# Altium schematic sheet NAVIGATION-PHERIPHERAL.SchDoc
size A3; SheetNumber: 4; SheetTotal: 7
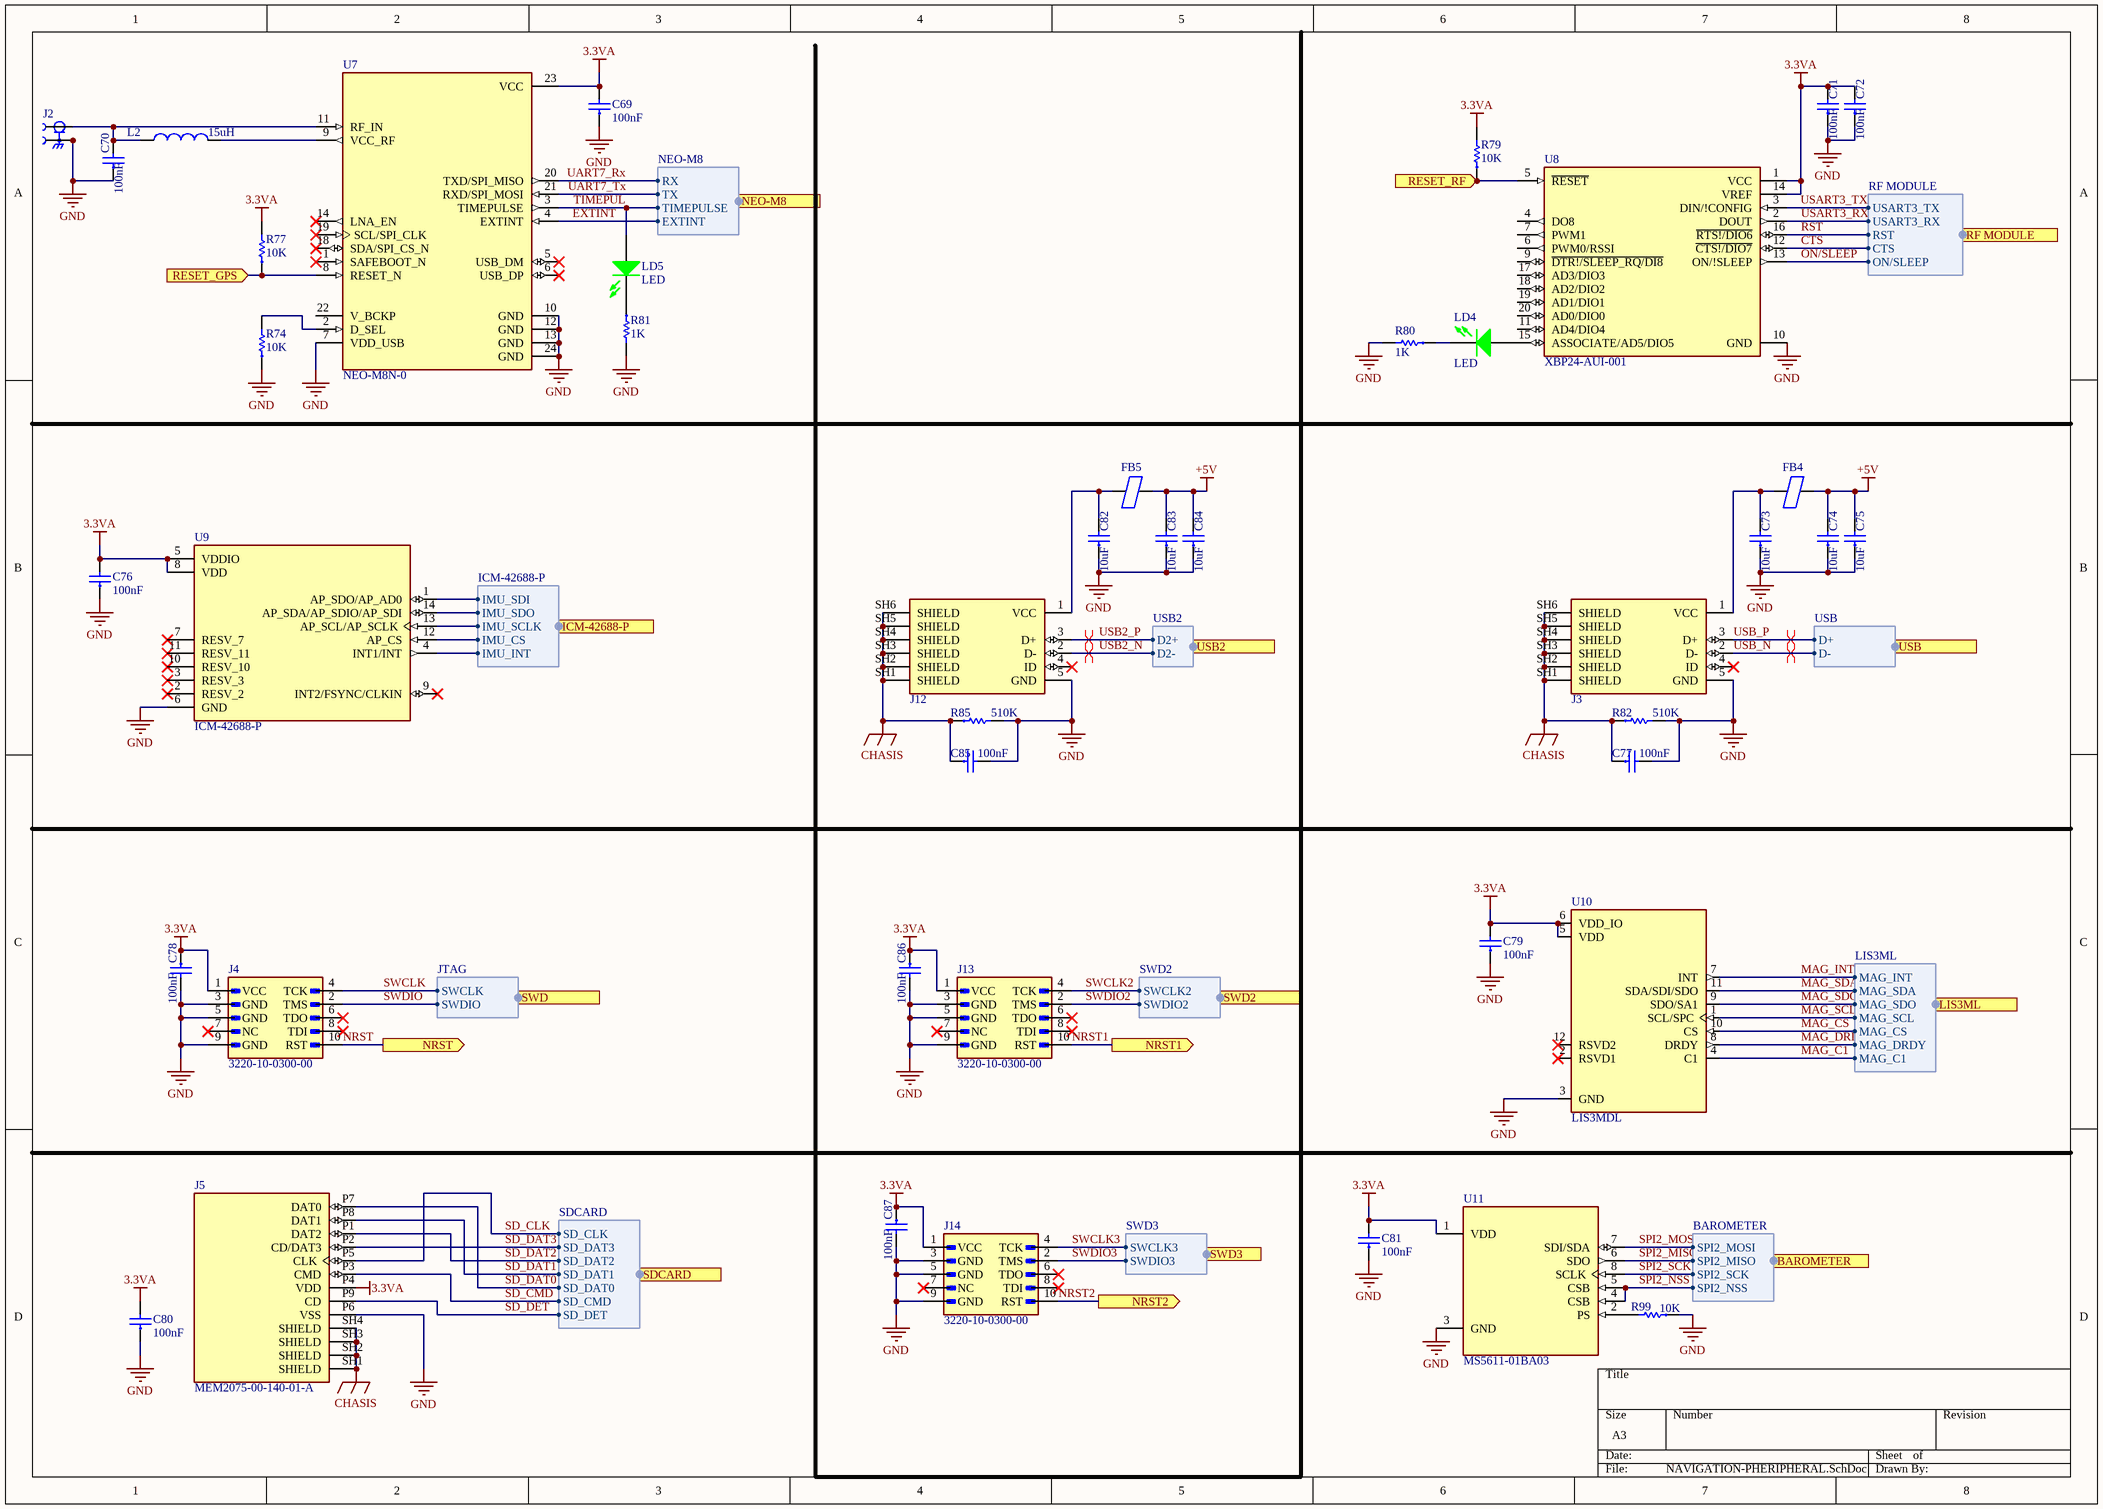
[diagram p0: NAVIGATION-PHERIPHERAL.SchDoc]

## Parts
C69  100nF  [CAP-CER0402-0.5H]
C70  100nF  [CAP-CER0402-0.5H]
C71  100nF  [CAP-CER0402-0.5H]
C72  100nF  [CAP-CER0402-0.5H]
C73  10uF  [CAP-CER0402-20mil]
C74  10uF  [CAP-CER0402-20mil]
C75  10uF  [CAP-CER0402-20mil]
C76  100nF  [CAP-CER0402-0.5H]
C77  100nF  [CAP-CER0603-0.8H]
C78  100nF  [CAP-CER0402-0.5H]
C79  100nF  [CAP-CER0402-0.5H]
C80  100nF  [CAP-CER0402-0.5H]
C81  100nF  [CAP-CER0402-0.5H]
C82  10uF  [CAP-CER0402-20mil]
C83  10uF  [CAP-CER0402-20mil]
C84  10uF  [CAP-CER0402-20mil]
C85  100nF  [CAP-CER0603-0.8H]
C86  100nF  [CAP-CER0402-0.5H]
C87  100nF  [CAP-CER0402-0.5H]
FB4  100MHz 2A 50mOhm  [FB 0603]  (value not drawn)
FB5  100MHz 2A 50mOhm  [FB 0603]  (value not drawn)
J2  CONUFL001-SMD  [LINX_CONUFL001-SMD]  (value not drawn)
J3  MICRO B  [MICRO USB B]  (value not drawn)
J4  3220-10-0300-00  [CNC_3220-10-0300-00]
J5  MEM2075-00-140-01-A  [GCT_MEM2075-00-140-01-A]
J12  MICRO B  [MICRO USB B]  (value not drawn)
J13  3220-10-0300-00  [CNC_3220-10-0300-00]
J14  3220-10-0300-00  [CNC_3220-10-0300-00]
L2  15uH  [INDC1106X70N]
LD4  LED  [LED-IND0402-GRE-0.4H]
LD5  LED  [LED-IND0402-GRE-0.4H]
R74  10K  [RES-CHP0402-0.35H]
R77  10K  [RES-CHP0402-0.35H]
R79  10K  [RES-CHP0402-0.35H]
R80  1K  [RES-CHP0402-0.35H]
R81  1K  [RES-CHP0402-0.35H]
R82  510K  [RES-CHP0402-0.35H]
R85  510K  [RES-CHP0402-0.35H]
R99  10K  [RES-CHP0402-0.35H]
U7  NEO-M8N-0  [XCVR_NEO-M8N-0]
U8  XBP24-AUI-001  [XBP24-AUI-001]
U9  ICM-42688-P  [PQFN50P300X250X97-14N]
U10  LIS3MDL  [XDCR_LIS3MDL]
U11  MS5611-01BA03  [SON125P500X300X100-8N]

## Ports
BAROMETER (harness BAROMETER), ICM-42688-P (harness ICM-42688-P), LIS3ML (harness LIS3ML), NEO-M8 (harness NEO-M8), NRST1 (out), NRST2 (out), NRST (out), RESET_GPS (in), RESET_RF (in), RF MODULE (harness RF MODULE), SDCARD (harness SDCARD), SWD2 (harness SWD2), SWD3 (harness SWD3), SWD (harness JTAG), USB2 (harness USB2), USB (harness USB)

## Harnesses
NEO-M8: RX, TX, TIMEPULSE, EXTINT
RF MODULE: USART3_TX, USART3_RX, RST, CTS, ON/SLEEP
ICM-42688-P: IMU_SDI, IMU_SDO, IMU_SCLK, IMU_CS, IMU_INT
USB: D-, D+
LIS3ML: MAG_INT, MAG_SDA, MAG_SDO, MAG_SCL, MAG_CS, MAG_DRDY, MAG_C1
BAROMETER: SPI2_MOSI, SPI2_MISO, SPI2_SCK, SPI2_NSS
SDCARD: SD_CLK, SD_DAT3, SD_DAT2, SD_DAT1, SD_DAT0, SD_CMD, SD_DET
USB2: D2-, D2+
JTAG: SWDIO, SWCLK
SWD2: SWDIO2, SWCLK2
SWD3: SWDIO3, SWCLK3

## Nets
3.3VA: C69.2 C71.2 C72.2 C76.2 C78.1 C79.2 C80.2 C81.2 C86.1 C87.1 J4.1(VCC) J5.P4(VDD) J13.1(VCC) J14.1(VCC) R77.2 R79.2 U7.23(VCC) U8.1(VCC) U8.14(VREF) U9.5(VDDIO) U9.8(VDD) U10.5(VDD) U10.6(VDD_IO) U11.1(VDD)
+5V: C74.2 C75.2 C83.2 C84.2 FB4.2 FB5.2
CHASIS: C77.1 C85.1 J3.SH1(SHIELD) J3.SH2(SHIELD) J3.SH3(SHIELD) J3.SH4(SHIELD) J3.SH5(SHIELD) J3.SH6(SHIELD) J5.SH1(SHIELD) J5.SH2(SHIELD) J5.SH3(SHIELD) J5.SH4(SHIELD) J12.SH1(SHIELD) J12.SH2(SHIELD) J12.SH3(SHIELD) J12.SH4(SHIELD) J12.SH5(SHIELD) J12.SH6(SHIELD) R82.1 R85.1
GND: C69.1 C70.1 C71.1 C72.1 C73.1 C74.1 C75.1 C76.1 C77.2 C78.2 C79.1 C80.1 C81.1 C82.1 C83.1 C84.1 C85.2 C86.2 C87.2 J2.2 J2.3 J3.5(GND) J4.3(GND) J4.5(GND) J4.9(GND) J5.P6(VSS) J12.5(GND) J13.3(GND) J13.5(GND) J13.9(GND) J14.3(GND) J14.5(GND) J14.9(GND) R74.1 R80.2 R81.2 R82.2 R85.2 R99.1 U7.7(VDD_USB) U7.10(GND) U7.12(GND) U7.13(GND) U7.24(GND) U8.10(GND) U9.6(GND) U10.3(GND) U11.3(GND)
CTS: U8.12(~{CTS!/DIO7}) ; port RF MODULE.CTS
EXTINT: U7.4(EXTINT) ; port NEO-M8.EXTINT
MAG_C1: U10.4(C1) ; port LIS3ML.MAG_C1
MAG_CS: U10.10(CS) ; port LIS3ML.MAG_CS
MAG_DRDY: U10.8(DRDY) ; port LIS3ML.MAG_DRDY
MAG_INT: U10.7(INT) ; port LIS3ML.MAG_INT
MAG_SCL: U10.1(SCL/SPC) ; port LIS3ML.MAG_SCL
MAG_SDA: U10.11(SDA/SDI/SDO) ; port LIS3ML.MAG_SDA
MAG_SDO: U10.9(SDO/SA1) ; port LIS3ML.MAG_SDO
NRST: J4.10(RST) ; port NRST
NRST1: J13.10(RST) ; port NRST1
NRST2: J14.10(RST) ; port NRST2
ON/SLEEP: U8.13(ON/!SLEEP) ; port RF MODULE.ON/SLEEP
RESET_GPS: R77.1 U7.8(RESET_N) ; port RESET_GPS
RESET_RF: R79.1 U8.5(~{RESET}) ; port RESET_RF
RST: U8.16(~{RTS!/DIO6}) ; port RF MODULE.RST
SD_CLK: J5.P5(CLK) ; port SDCARD.SD_CLK
SD_CMD: J5.P3(CMD) ; port SDCARD.SD_CMD
SD_DAT0: J5.P7(DAT0) ; port SDCARD.SD_DAT0
SD_DAT1: J5.P8(DAT1) ; port SDCARD.SD_DAT1
SD_DAT2: J5.P1(DAT2) ; port SDCARD.SD_DAT2
SD_DAT3: J5.P2(CD/DAT3) ; port SDCARD.SD_DAT3
SD_DET: J5.P9(CD) ; port SDCARD.SD_DET
SPI2_MISO: U11.6(SDO) ; port BAROMETER.SPI2_MISO
SPI2_MOSI: U11.7(SDI/SDA) ; port BAROMETER.SPI2_MOSI
SPI2_NSS: U11.4(CSB) U11.5(CSB) ; port BAROMETER.SPI2_NSS
SPI2_SCK: U11.8(SCLK) ; port BAROMETER.SPI2_SCK
SWCLK: J4.4(TCK) ; port SWD.SWCLK
SWCLK2: J13.4(TCK) ; port SWD2.SWCLK2
SWCLK3: J14.4(TCK) ; port SWD3.SWCLK3
SWDIO: J4.2(TMS) ; port SWD.SWDIO
SWDIO2: J13.2(TMS) ; port SWD2.SWDIO2
SWDIO3: J14.2(TMS) ; port SWD3.SWDIO3
TIMEPUL: LD5.1(A) U7.3(TIMEPULSE) ; port NEO-M8.TIMEPULSE
UART7_Rx: U7.20(TXD/SPI_MISO) ; port NEO-M8.RX
UART7_Tx: U7.21(RXD/SPI_MOSI) ; port NEO-M8.TX
USART3_RX: U8.2(DOUT) ; port RF MODULE.USART3_RX
USART3_TX: U8.3(DIN/!CONFIG) ; port RF MODULE.USART3_TX
USB2_N: J12.2(D-) ; port USB2.D2-
USB2_P: J12.3(D+) ; port USB2.D2+
USB_N: J3.2(D-) ; port USB.D-
USB_P: J3.3(D+) ; port USB.D+
NetC70_2: C70.2 J2.1 L2.1 U7.11(RF_IN)
NetC73_2: C73.2 FB4.1 J3.1(VCC)
NetC82_2: C82.2 FB5.1 J12.1(VCC)
NetL2_2: L2.2 U7.9(VCC_RF)
NetLD4_1: LD4.1(A) U8.15(ASSOCIATE/AD5/DIO5)
NetLD4_2: LD4.2(K) R80.1
NetLD5_2: LD5.2(K) R81.1
NetR74_2: R74.2 U7.2(D_SEL)
NetR99_2: R99.2 U11.2(PS)
NetU9_1: U9.1(AP_SDO/AP_AD0) ; port ICM-42688-P.IMU_SDI
NetU9_4: U9.4(INT1/INT) ; port ICM-42688-P.IMU_INT
NetU9_12: U9.12(AP_CS) ; port ICM-42688-P.IMU_CS
NetU9_13: U9.13(AP_SCL/AP_SCLK) ; port ICM-42688-P.IMU_SCLK
NetU9_14: U9.14(AP_SDA/AP_SDIO/AP_SDI) ; port ICM-42688-P.IMU_SDO

Not connected (* = marked no-connect by the designer): J3 4(ID)*; J4 6(TDO)* 7(NC)* 8(TDI)*; J12 4(ID)*; J13 6(TDO)* 7(NC)* 8(TDI)*; J14 6(TDO)* 7(NC)* 8(TDI)*; U7 1(SAFEBOOT_N)* 5(USB_DM)* 6(USB_DP)* 14(LNA_EN)* 18(SDA/SPI_CS_N)* 19(SCL/SPI_CLK)* 22(V_BCKP); U8 4(DO8) 6(PWM0/RSSI) 7(PWM1) 9(~{DTR!/SLEEP_RQ/DI8}) 11(AD4/DIO4) 17(AD3/DIO3) 18(AD2/DIO2) 19(AD1/DIO1) 20(AD0/DIO0); U9 2(RESV_2)* 3(RESV_3)* 7(RESV_7)* 9(INT2/FSYNC/CLKIN)* 10(RESV_10)* 11(RESV_11)*; U10 2(RSVD1)* 12(RSVD2)*

## Layout directives
differential pair: USB2_N, USB2_P, USB_N, USB_P

## Library data of the parts
C69-C72 C76 C78-C81 C86 C87 = CAPCER0013 100nF 10% 50V X7R 0402 SMD: CAP CER 100nF 10% 50V X7R 0402 SMD; LINE: SMT; TYPE: EP; UNIT: PCS; TMG CODE: None; CERTIFICATION: NA; CLASS: B; MOUNT: SMD; TMG PN: CAPCER0013; ComponentLink1Description: Datasheet; ComponentLink1URL: https://datasheet.lcsc.com/lcsc/1811021431_Samsung-Electro-Mechanics-CL10B104KB8NNNC_C1591.pdf; Footprint: 0402
C73-C75 C82-C84 = CAPCER0040 10uF 20% 6.3V X5R 0402 SMD: CAP CER 10uF 20% 6.3V X5R 0402 SMD; LINE: SMT; TYPE: EP; UNIT: PCS; TMG PN: CAPCER0013; TMG CODE: None; CERTIFICATION: NA; CLASS: B; MOUNT: SMD; ComponentLink1Description: Datasheet; ComponentLink1URL: https://datasheet.lcsc.com/lcsc/2304140030_YAGEO-CC0402MRX5R5BB106_C105884.pdf; Footprint: 0402
C77 C85 = CAPCER0001 100nF 10% 50V X7R 0603 SMD: CAP CER 100nF 10% 50V X7R 0603 SMD; LINE: SMT; TYPE: EP; UNIT: PCS; TMG CODE: None; CERTIFICATION: NA; CLASS: B; MOUNT: SMD; TMG PN: CAPCER0001; ComponentLink1Description: Datasheet; ComponentLink1URL: https://datasheet.lcsc.com/lcsc/1811021431_Samsung-Electro-Mechanics-CL10B104KB8NNNC_C1591.pdf; Footprint: 0603
FB4 FB5 = BLM18PG121SN1D: Ferrite Beads Multi-Layer 120Ohm 25% 100MHz 2A 50mOhm DCR 0603 Paper T/R; Manufacturer: Murata; Material: Steel,Ferrite; Impedance: 120R; Number of Lines: 1; DC Resistance (DCR): 50mR; Number of Circuits: 1NUMBER; Shielding: 202Shielding; Supplier 1: Mouser; Manufacturer Part Number: BLM18PG121SN1D; RoHS: Yes; Category: Ferrite Beads and Chips; Stock 1: 377848; Pricing 1: 1=0.1, 10=0.059, 50=0.047, 100=0.042, 1000=0.029, 10000=0.018 (USD); Case/Package: 0603; Number of Pins: 2; Core Material: Ferrite; Case Code (Metric): 1608; Case Code (Imperial): 0603; Min Operating Temperature: -55°C; Max Operating Temperature: 125°C; Tolerance: 25%; Package Quantity: 1; Max Current Rating: 2A; Packaging: Tape and Reel; Current Rating: 2A; Max DC Current: 2A; Termination: SMD/SMT; Test Frequency: 100MHz; DC Current: 2A; Frequency: 100MHz; Series: BLM18P; DC Resistance-Max: 50mR; RMS Current (Irms): 2A; Series Resistance: 50mR; Length: 1.6mm; Width: 0.8mm; Height: 0.8mm; Depth: 0.8mm; Radiation Hardening: No; Reach SVHC Compliant: No; Lead Free: Lead Free; RoHS Compliant: Yes; ComponentLink1URL: https://datasheet.ciiva.com/5709/1740433-5709171.pdf?src-supplier=Farnell; ComponentLink1Description: https://datasheet.ciiva.com/5709/1740433-5709171.pdf?src-supplier=Farnell; ComponentLink2URL: https://datasheet.ciiva.com/19454/1845013-19454715.pdf?src-supplier=Jameco; ComponentLink2Description: https://datasheet.ciiva.com/19454/1845013-19454715.pdf?src-supplier=Jameco; ComponentLink3URL: https://datasheet.ciiva.com/11799/0900766b81275ca5-11799546.pdf?src-supplier=Rs; ComponentLink3Description: https://datasheet.ciiva.com/11799/0900766b81275ca5-11799546.pdf?src-supplier=Rs; ComponentLink4URL: https://datasheet.ciiva.com/3854/5emiapbde-1-3854039.pdf?src-supplier=Arrow+Electronics; ComponentLink4Description: https://datasheet.ciiva.com/3854/5emiapbde-1-3854039.pdf?src-supplier=Arrow+Electronics; ComponentLink5URL: https://datasheet.ciiva.com/29347/442365-da-01-en-chip-drossel-0603-120r-2000ma-1-6x0-8mm-29347911.pdf?src-supplier=Conrad; ComponentLink5Description: https://datasheet.ciiva.com/29347/442365-da-01-en-chip-drossel-0603-120r-2000ma-1-6x0-8mm-29347911.pdf?src-supplier=Conrad; ComponentLink6URL: https://datasheet.ciiva.com/8021/1740433-8021493.pdf?src-supplier=Element14; ComponentLink6Description: https://datasheet.ciiva.com/8021/1740433-8021493.pdf?src-supplier=Element14; ComponentLink7URL: https://datasheet.ciiva.com/8021/1740433-8021494.pdf?src-supplier=Element14; ComponentLink7Description: https://datasheet.ciiva.com/8021/1740433-8021494.pdf?src-supplier=Element14; ComponentLink8URL: https://datasheet.ciiva.com/14122/blm-series-eng-tds-14122905.pdf?src-supplier=Distrelec; ComponentLink8Description: https://datasheet.ciiva.com/14122/blm-series-eng-tds-14122905.pdf?src-supplier=Distrelec; ComponentLink9URL: https://datasheet.ciiva.com/6212/l0110s0100blm18p-6212502.pdf?src-supplier=Digikey; ComponentLink9Description: https://datasheet.ciiva.com/6212/l0110s0100blm18p-6212502.pdf?src-supplier=Digikey; ComponentLink10URL: https://datasheet.ciiva.com/6212/l0110s0100blm18p-6212504.pdf?src-supplier=Digikey; ComponentLink10Description: https://datasheet.ciiva.com/6212/l0110s0100blm18p-6212504.pdf?src-supplier=Digikey; ComponentLink11URL: https://datasheet.ciiva.com/3081/l0110s0100blm18p-3081632.pdf?src-supplier=Avnet; ComponentLink11Description: https://datasheet.ciiva.com/3081/l0110s0100blm18p-3081632.pdf?src-supplier=Avnet; ComponentLink12URL: https://datasheet.ciiva.com/41449/001172297-da-01-en-drossel-0603-120r-1-6x0-8mm-4000st-41449659.pdf?src-supplier=Conrad; ComponentLink12Description: https://datasheet.ciiva.com/41449/001172297-da-01-en-drossel-0603-120r-1-6x0-8mm-4000st-41449659.pdf?src-supplier=Conrad; Supplier Part Number 1: 81-BLM18PG121SN1D
J2 = CONUFL001-SMD: MF: Linx; Availability: In Stock; Price: None; SnapEDA_Link: https://www.snapeda.com/parts/CONUFL001-SMD/Linx/view-part/5842340/?ref=snap; Value: *; Check_prices: https://www.snapeda.com/parts/CONUFL001-SMD/Linx/view-part/5842340/?ref=eda; MP: CONUFL001-SMD; Package: None
J3 J12 = MICRO USB B
J4 J13 J14 = 3220-10-0300-00: Connector Header Surface Mount 10 position 0.050 (1.27mm); MF: CNC Tech; SnapEDA_Link: https://www.snapeda.com/parts/3220-10-0300-00/CNC+Tech/view-part/?ref=snap; Package: None; Value: *; MP: 3220-10-0300-00; Check_prices: https://www.snapeda.com/parts/3220-10-0300-00/CNC+Tech/view-part/?ref=eda
J5 = MEM2075-00-140-01-A: 9 (8 + 1) Position Card Connector microSD Surface Mount, Right Angle Gold; MF: Global Connector Technology; SnapEDA_Link: https://www.snapeda.com/parts/MEM2075-00-140-01-A/Global+Connector+Technology/view-part/?ref=snap; Package: None; Value: *; MP: MEM2075-00-140-01-A; Check_prices: https://www.snapeda.com/parts/MEM2075-00-140-01-A/Global+Connector+Technology/view-part/?ref=eda
L2 = LQW15DN100M00D: MF: {'manufacturer': u'Murata Electronics'}; Package: None; Price: None; Value: *; MP: LQW15DN100M00D; Availability: Unavailable
LD4 LD5 = LEDIND0005 GRE CLR 2.4V 20mA 0402 SMD: LED IND GRE CLR 2.4V 20mA 0402 SMD; LINE: SMT; TYPE: EP; UNIT: PCS; TMG CODE: None; CERTIFICATION: NA; CLASS: B; MOUNT: SMD; ComponentLink1Description: Datasheet; ComponentLink1URL: https://datasheet.lcsc.com/lcsc/2102221739_Yongyu-Photoelectric-SZYY0402YG_C434449.pdf
R74 R77 R79 = RESCHP0073 10K 1% 0402 SMD: RES CHP 10K 1% 1/16W 0402 SMD; LINE: SMT; UNIT: PCS; TMG CODE: None; CERTIFICATION: NA; CLASS: B; MOUNT: SMD; TYPE: EP; TMG PN: RESCHP0073; ComponentLink1Description: Datasheet; ComponentLink1URL: https://datasheet.lcsc.com/lcsc/2304140030_YAGEO-AC0402FR-0710KL_C144807.pdf; Footprint: 0402
R80 R81 R99 = RESCHP0097 100K 1% 0402 SMD: RES CHP 100K 1% 1/16W 0402 SMD; LINE: SMT; UNIT: PCS; TMG CODE: None; CERTIFICATION: NA; CLASS: B; MOUNT: SMD; TYPE: EP; ComponentLink1Description: Datasheet; ComponentLink1URL: https://datasheet.lcsc.com/lcsc/2304140030_YAGEO-AC0402FR-0710KL_C144807.pdf
R82 R85 = RESCHP0114 510K 1% 0402 SMD: RES CHP 510K 1% 1/16W 0402 SMD; LINE: SMT; UNIT: PCS; TMG CODE: None; CERTIFICATION: NA; CLASS: B; MOUNT: SMD; TYPE: EP; ComponentLink1Description: Datasheet; ComponentLink1URL: https://datasheet.lcsc.com/lcsc/2304140030_YAGEO-RC0402FR-07510KL_C137961.pdf
U7 = NEO-M8N-0: series RF Receiver BeiDou, Galileo, GLONASS, GNSS, GPS 1.575GHz -167dBm - - -; MF: U-Blox America; SnapEDA_Link: https://www.snapeda.com/parts/NEO-M8N-0/u-blox/view-part/?ref=snap; Package: SMD-24 U-Blox America Inc.; Value: *; MP: NEO-M8N-0; Check_prices: https://www.snapeda.com/parts/NEO-M8N-0/u-blox/view-part/?ref=eda
U8 = XBP24-AUI-001: Xbee-Pro 802.15.4, 63mw, Wire Antenna, 250000 Bps; Higher Tran; Package: None; Price: None; Value: *; MP: XBP24-AUI-001; Availability: Unavailable
U9 = ICM-42688-P: Accelerometer, Gyroscope, 6 Axis Sensor Output; Package: None; MP: ICM-42688-P; Value: *; Availability: Unavailable; Price: None
U10 = LIS3MDL: Magnetoresistive Sensor X, Y, Z Axis 12-LGA (2x2); MF: STMicroelectronics; SnapEDA_Link: https://www.snapeda.com/parts/LIS3MDL/STMicroelectronics/view-part/?ref=snap; Package: VFLGA-12 STMicroelectronics; Value: *; MP: LIS3MDL; Check_prices: https://www.snapeda.com/parts/LIS3MDL/STMicroelectronics/view-part/?ref=eda
U11 = MS5611-01BA03: Pressure Sensor 0.15PSI ~ 17.4PSI (1kPa ~ 120kPa) Absolute - 24 b 8-SMD; MF: TE Connectivity; Package: SMD-8 Measurement Specialties; Price: None; Value: *; SnapEDA_Link: https://www.snapeda.com/parts/MS5611-01BA03/TE+Connectivity+ALCOSWITCH+Switches/view-part/?ref=snap; MP: MS5611-01BA03; Availability: Not in stock; Check_prices: https://www.snapeda.com/parts/MS5611-01BA03/TE+Connectivity+ALCOSWITCH+Switches/view-part/?ref=eda